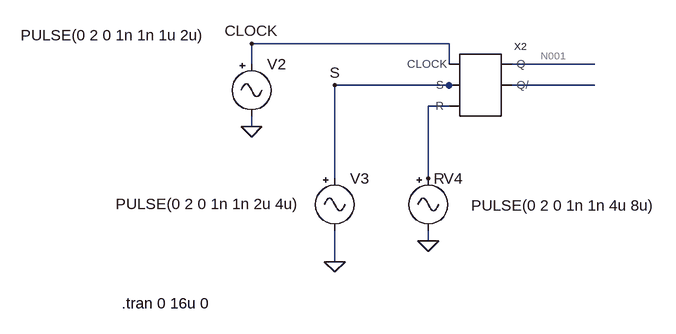
[diagram p0: schematic Counter.asc]
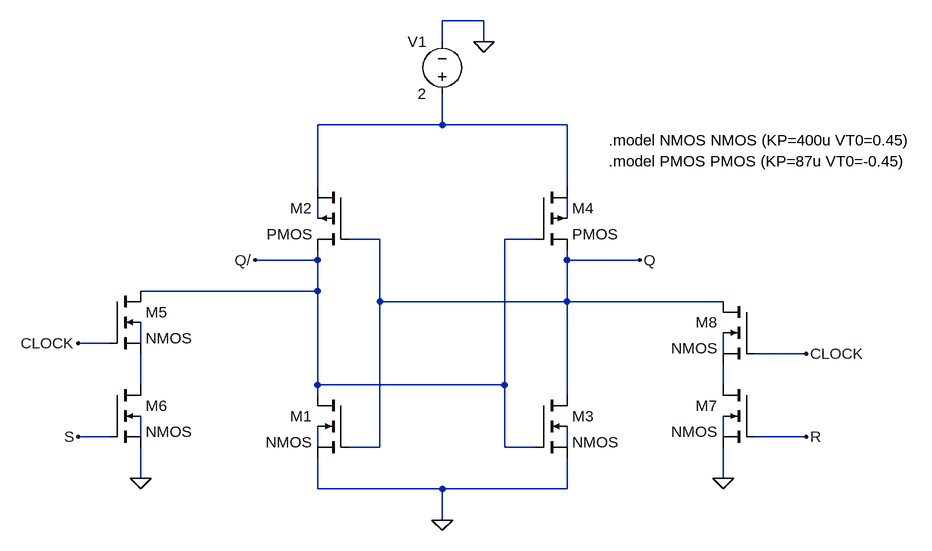
[diagram p1: sub-circuit flipflop.asc]
Counter.asc, the LTspice schematic file:
Version 4
SHEET 1 1244 680
WIRE 720 -96 416 -96
WIRE 416 -64 416 -96
WIRE 720 -64 720 -96
WIRE 944 -64 816 -64
WIRE 720 -32 544 -32
WIRE 736 -32 720 -32
WIRE 944 -32 816 -32
WIRE 720 0 688 0
WIRE 416 32 416 16
WIRE 544 112 544 -32
WIRE 688 112 688 0
WIRE 688 208 688 192
WIRE 544 240 544 192
FLAG 416 -96 CLOCK
FLAG 544 -32 S
FLAG 688 112 R
FLAG 416 32 0
FLAG 544 240 0
FLAG 688 208 0
SYMBOL Misc\\signal 416 -80 R0
WINDOW 123 0 0 Left 0
WINDOW 39 0 0 Left 0
WINDOW 3 -355 -29 Left 2
SYMATTR Value PULSE(0 2 0 1n 1n 1u 2u)
SYMATTR InstName V2
SYMBOL Misc\\signal 544 96 R0
WINDOW 123 0 0 Left 0
WINDOW 39 0 0 Left 0
WINDOW 3 -337 55 Left 2
SYMATTR Value PULSE(0 2 0 1n 1n 2u 4u)
SYMATTR InstName V3
SYMBOL Misc\\signal 688 96 R0
WINDOW 123 0 0 Left 0
WINDOW 39 0 0 Left 0
WINDOW 3 66 57 Left 2
SYMATTR Value PULSE(0 2 0 1n 1n 4u 8u)
SYMATTR InstName V4
SYMBOL flipflop 768 -32 R0
SYMATTR InstName X2
TEXT 216 304 Left 2 !.tran 0 16u 0

flipflop.asc, the sub-circuit schematic file:
Version 4
SHEET 1 880 680
WIRE -16 -176 -80 -176
WIRE -80 -144 -80 -176
WIRE -16 -144 -16 -176
WIRE -80 -16 -80 -64
WIRE -80 -16 -272 -16
WIRE 112 -16 -80 -16
WIRE -272 80 -272 -16
WIRE 112 80 112 -16
WIRE -272 128 -272 96
WIRE 112 128 112 96
WIRE -176 160 -224 160
WIRE 64 160 16 160
WIRE -272 192 -272 176
WIRE -272 192 -368 192
WIRE 112 192 112 176
WIRE 224 192 112 192
WIRE -272 240 -272 192
WIRE -272 240 -544 240
WIRE -176 256 -176 160
WIRE 112 256 112 192
WIRE 112 256 -176 256
WIRE 352 256 112 256
WIRE -592 320 -640 320
WIRE -544 320 -544 288
WIRE 352 336 352 304
WIRE 480 336 400 336
WIRE -544 384 -544 336
WIRE -272 384 -272 240
WIRE 16 384 16 160
WIRE 16 384 -272 384
WIRE 352 384 352 352
WIRE -272 400 -272 384
WIRE 112 400 112 256
WIRE -592 464 -640 464
WIRE -544 464 -544 432
WIRE 352 464 352 432
WIRE 480 464 400 464
WIRE -272 480 -272 448
WIRE -176 480 -176 256
WIRE -176 480 -224 480
WIRE 16 480 16 384
WIRE 64 480 16 480
WIRE 112 480 112 448
WIRE -544 528 -544 480
WIRE 352 528 352 480
WIRE -272 544 -272 496
WIRE -80 544 -272 544
WIRE 112 544 112 496
WIRE 112 544 -80 544
WIRE -80 592 -80 544
FLAG -16 -144 0
FLAG -80 592 0
FLAG -544 528 0
FLAG 352 528 0
FLAG -640 320 CLOCK
FLAG 480 336 CLOCK
FLAG -368 192 Q/
FLAG 224 192 Q
FLAG -640 464 S
FLAG 480 464 R
SYMBOL voltage -80 -48 R180
WINDOW 0 24 96 Left 2
WINDOW 3 24 16 Left 2
WINDOW 123 0 0 Left 0
WINDOW 39 0 0 Left 0
SYMATTR InstName V1
SYMATTR Value 2
SYMBOL nmos4 -224 400 M0
SYMATTR InstName M1
SYMATTR Value2 l=0.15u w=0.63u
SYMBOL pmos4 -224 80 M0
SYMATTR InstName M2
SYMATTR Value2 l=0.15u w=2.86u
SYMBOL nmos4 64 400 R0
SYMATTR InstName M3
SYMATTR Value2 l=0.15u w=0.63u
SYMBOL pmos4 64 80 R0
SYMATTR InstName M4
SYMATTR Value2 l=0.15u w=2.86u
SYMBOL nmos4 -592 240 R0
SYMATTR InstName M5
SYMATTR Value2 l=0.15u w=1.26u
SYMBOL nmos4 -592 384 R0
SYMATTR InstName M6
SYMATTR Value2 l=0.15u w=1.26u
SYMBOL nmos4 400 384 M0
SYMATTR InstName M7
SYMATTR Value2 l=0.15u w=1.26u
SYMBOL nmos4 400 256 M0
SYMATTR InstName M8
SYMATTR Value2 l=0.15u w=1.26u
TEXT 176 8 Left 2 !.model NMOS NMOS (KP=400u VT0=0.45)
TEXT 176 40 Left 2 !.model PMOS PMOS (KP=87u VT0=-0.45)

The netlist it stands for:
* Counter.asc
V2 CLOCK 0 PULSE(0 2 0 1n 1n 1u 2u)
V3 S 0 PULSE(0 2 0 1n 1n 2u 4u)
V4 R 0 PULSE(0 2 0 1n 1n 4u 8u)
XX2 CLOCK S R N001 N002 flipflop

* block symbol definitions
.subckt flipflop CLOCK S R Q Q/
V1 N001 0 2
M1 Q/ Q 0 N010 NMOS l=0.15u w=0.63u
M2 N001 Q Q/ N002 PMOS l=0.15u w=2.86u
M3 Q Q/ 0 N011 NMOS l=0.15u w=0.63u
M4 N001 Q/ Q N003 PMOS l=0.15u w=2.86u
M5 Q/ CLOCK N006 N004 NMOS l=0.15u w=1.26u
M6 N006 S 0 N008 NMOS l=0.15u w=1.26u
M7 N007 R 0 N009 NMOS l=0.15u w=1.26u
M8 Q CLOCK N007 N005 NMOS l=0.15u w=1.26u
.model NMOS NMOS (KP=400u VT0=0.45)
.model PMOS PMOS (KP=87u VT0=-0.45)
.ends flipflop

.model NMOS NMOS
.model PMOS PMOS
.lib standard.mos
.tran 0 16u 0
.backanno
.end

* Results of the author's LTspice run, read from the files saved beside the schematic
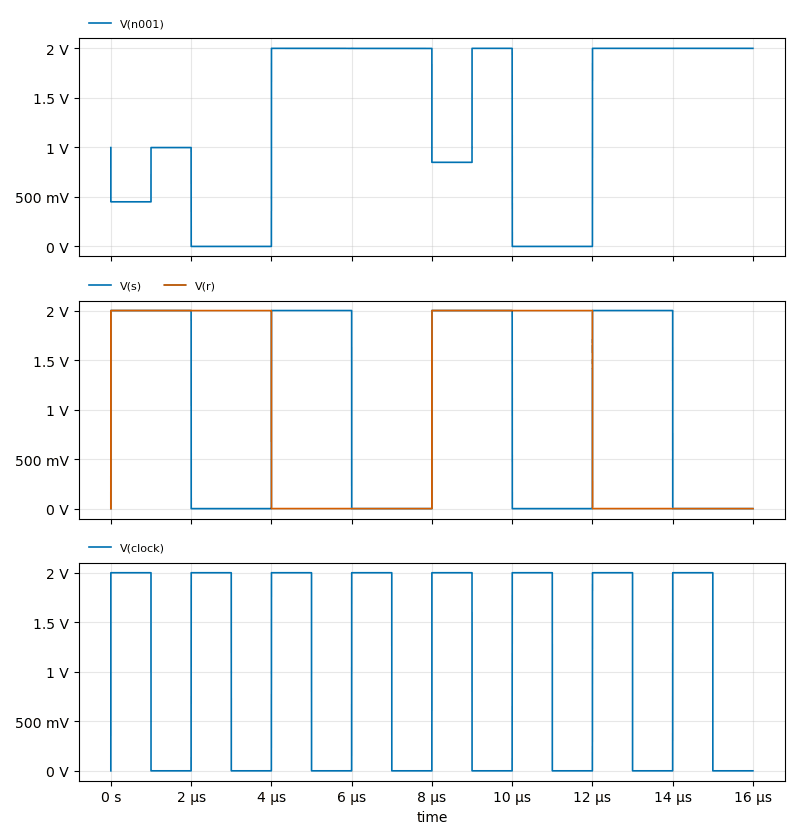
[diagram p2: Transient Analysis of Counter.asc, plotted from the saved traces]
* Transient Analysis, 1 run:
*   V(n001): min -238.4 nV, max 2 V, average 1.268 V, rms 1.539 V, last 2 V
*   V(s): min 0 V, max 2 V, average 1.001 V, rms 1.414 V, last 0 V
*   V(r): min 0 V, max 2 V, average 1 V, rms 1.414 V, last 0 V
*   V(clock): min 0 V, max 2 V, average 1.001 V, rms 1.415 V, last 0 V